# Altium schematic sheet vl822.SchDoc
size A3; SheetNumber: 4; SheetTotal: 4
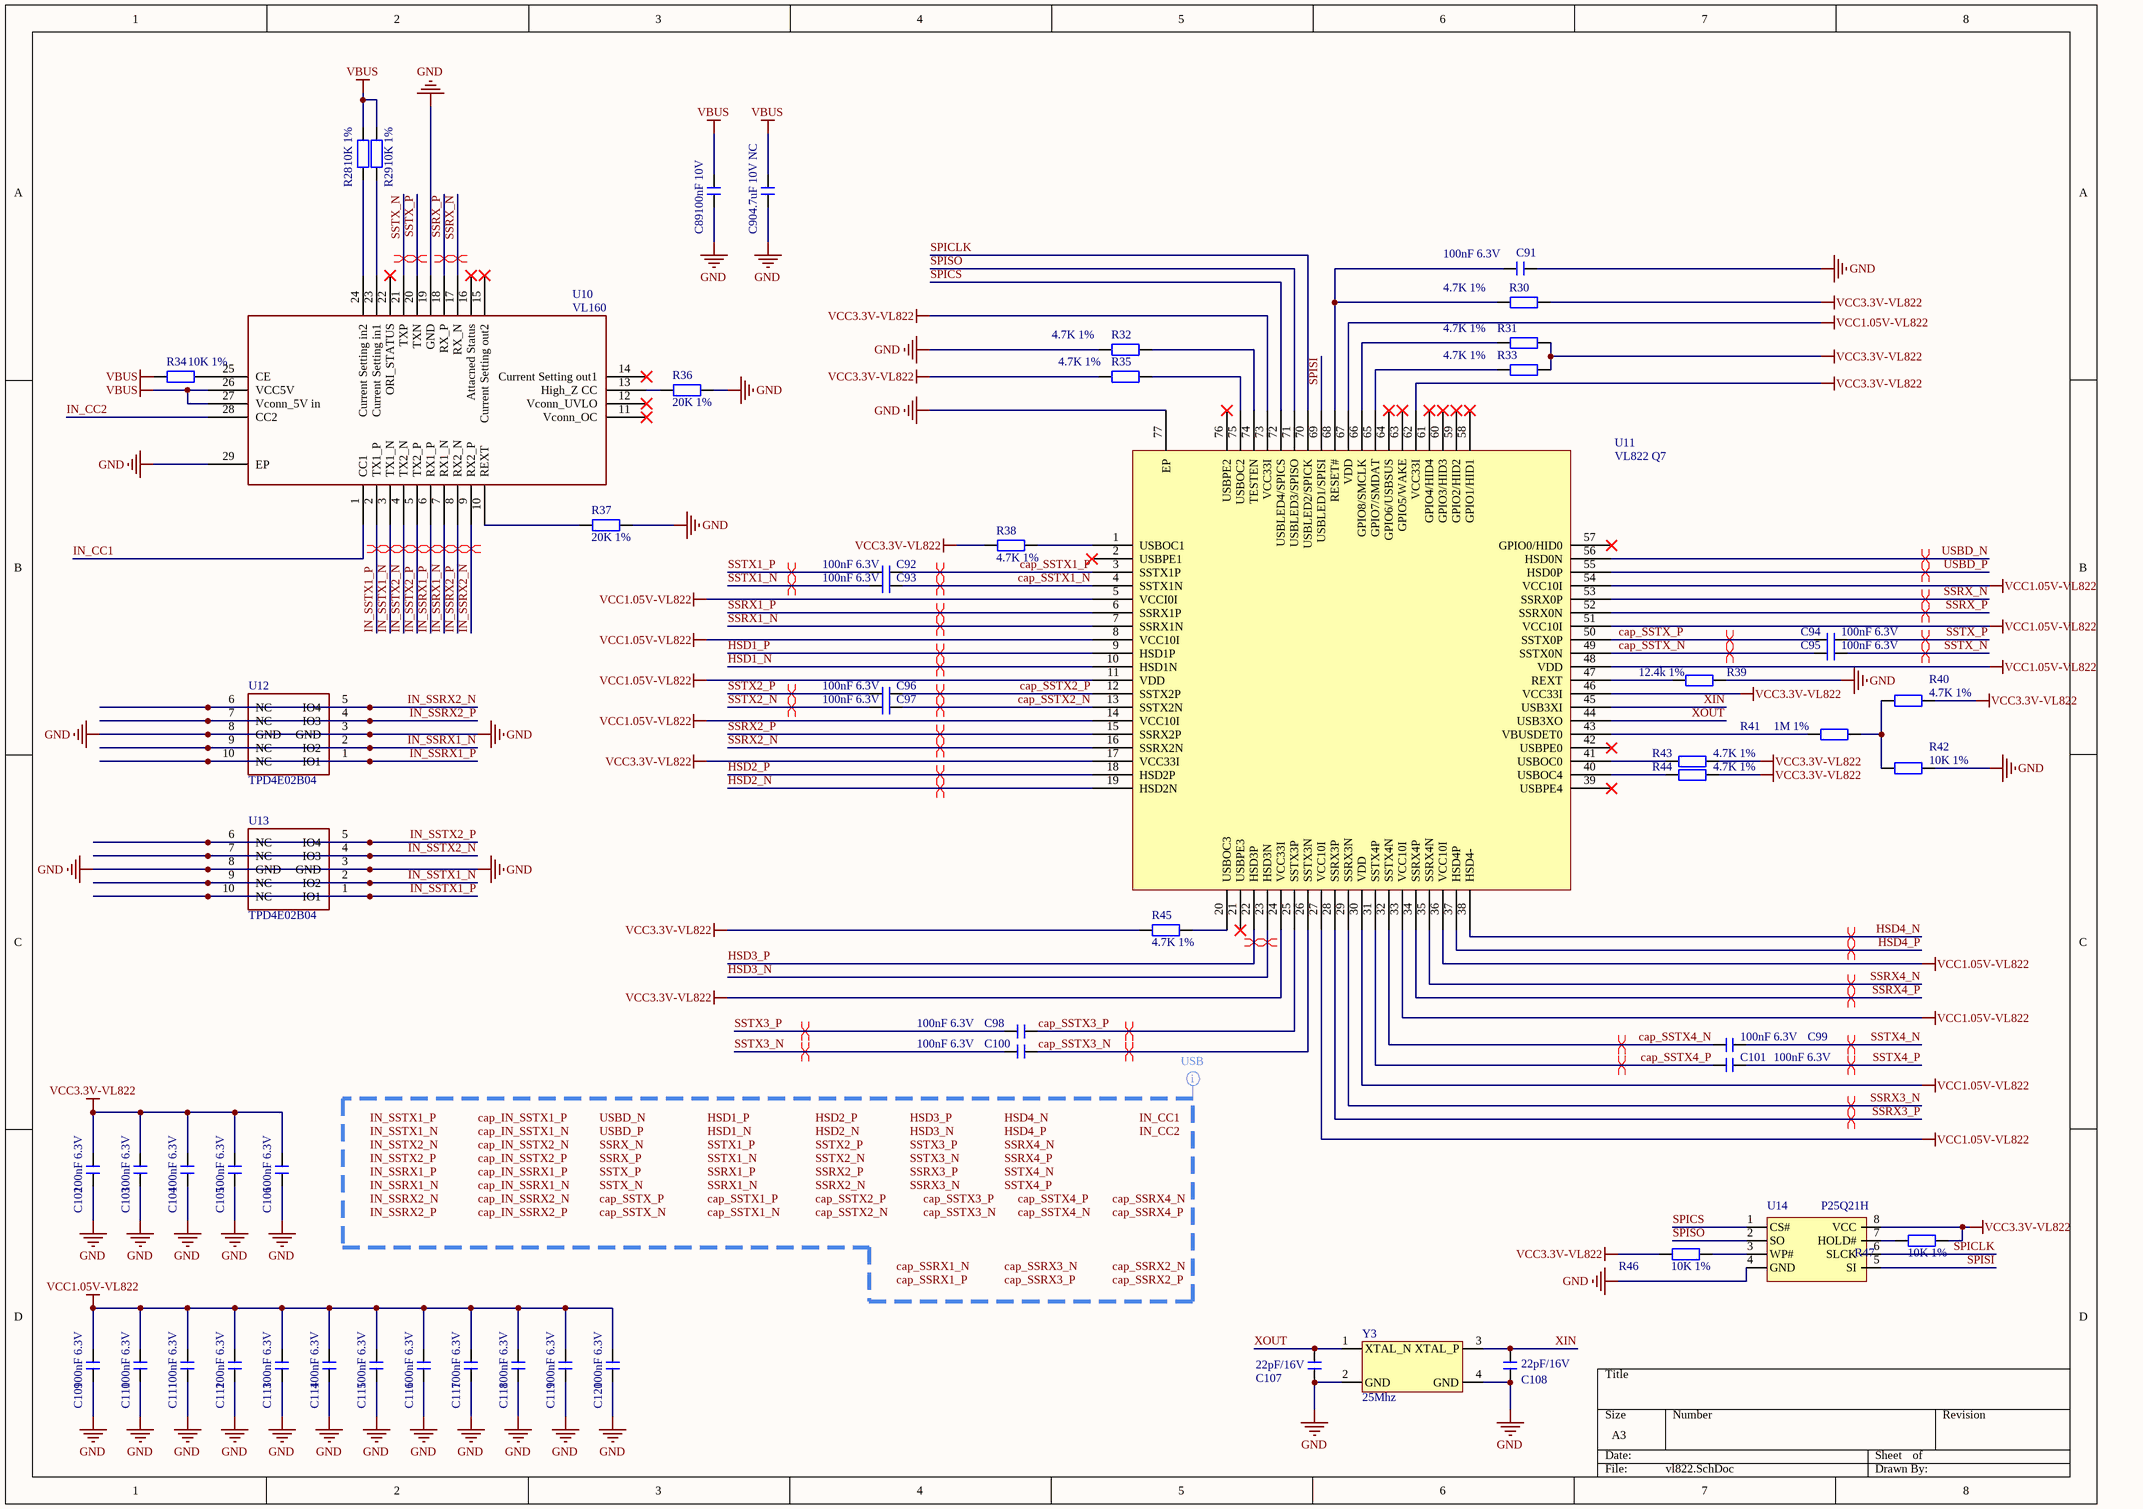
[diagram p0: vl822.SchDoc]

## Parts
C89  100nF 10V  [C0402_L]
C90  4.7uF 10V NC  [C0402_L]
C91  100nF 6.3V  [C0402_L]
C92  100nF 6.3V  [C0402_L]
C93  100nF 6.3V  [C0402_L]
C94  100nF 6.3V  [C0402_L]
C95  100nF 6.3V  [C0402_L]
C96  100nF 6.3V  [C0402_L]
C97  100nF 6.3V  [C0402_L]
C98  100nF 6.3V  [C0402_L]
C99  100nF 6.3V  [C0402_L]
C100  100nF 6.3V  [C0402_L]
C101  100nF 6.3V  [C0402_L]
C102  100nF 6.3V  [C0402_L]
C103  100nF 6.3V  [C0402_L]
C104  100nF 6.3V  [C0402_L]
C105  100nF 6.3V  [C0402_L]
C106  100nF 6.3V  [C0402_L]
C107  22pF/16V  [C0402_L]
C108  22pF/16V  [C0402_L]
C109  100nF 6.3V  [C0402_L]
C110  100nF 6.3V  [C0402_L]
C111  100nF 6.3V  [C0402_L]
C112  100nF 6.3V  [C0402_L]
C113  100nF 6.3V  [C0402_L]
C114  100nF 6.3V  [C0402_L]
C115  100nF 6.3V  [C0402_L]
C116  100nF 6.3V  [C0402_L]
C117  100nF 6.3V  [C0402_L]
C118  100nF 6.3V  [C0402_L]
C119  100nF 6.3V  [C0402_L]
C120  100nF 6.3V  [C0402_L]
R28  10K 1%  [R0402_L]
R29  10K 1%  [R0402_L]
R30  4.7K 1%  [R0402_L]
R31  4.7K 1%  [R0402_L]
R32  4.7K 1%  [R0402_L]
R33  4.7K 1%  [R0402_L]
R34  10K 1%  [R0402_L]
R35  4.7K 1%  [R0402_L]
R36  20K 1%  [R0402_L]
R37  20K 1%  [R0402_L]
R38  4.7K 1%  [R0402_L]
R39  12.4k 1%  [R0402_L]
R40  4.7K 1%  [R0402_L]
R41  1M 1%  [R0402_L]
R42  10K 1%  [R0402_L]
R43  4.7K 1%  [R0402_L]
R44  4.7K 1%  [R0402_L]
R45  4.7K 1%  [R0402_L]
R46  10K 1%  [R0402_L]
R47  10K 1%  [R0402_L]
U10  VL160  [MQFN-28_L4.5-W3.5-P0.40-BL-EP]
U11  VL822 Q7  [QFN-76_L9.0-W9.0-P0.40-EP6.3-TL]
U12  TPD4E02B04  [DIO_TPD4E02B04DQAR]
U13  TPD4E02B04  [DIO_TPD4E02B04DQAR]
U14  P25Q21H  [SOP8_L]
Y3  25Mhz  [OSC 3225-4P]

## Nets
GND: C89.1 C90.1 C91.2 C102.1 C103.1 C104.1 C105.1 C106.1 C107.2 C108.2 C109.1 C110.1 C111.1 C112.1 C113.1 C114.1 C115.1 C116.1 C117.1 C118.1 C119.1 C120.1 R32.2 R36.1 R37.1 R39.2 R42.2 U10.19(GND) U10.29(EP) U11.77(EP) U12.3(GND) U12.8(GND) U13.3(GND) U13.8(GND) U14.4(GND) Y3.2(GND) Y3.4(GND)
VBUS: C89.2 C90.2 R28.1 R29.1 R34.2 U10.26(VCC5V) U10.27(Vconn_5V_in)
VCC1.05V-VL822: C109.2 C110.2 C111.2 C112.2 C113.2 C114.2 C115.2 C116.2 C117.2 C118.2 C119.2 C120.2 U11.5(VCCI0I) U11.8(VCC10I) U11.11(VDD) U11.14(VCC10I) U11.27(VCC10I) U11.30(VDD) U11.33(VCC10I) U11.36(VCC10I) U11.48(VDD) U11.51(VCC10I) U11.54(VCC10I) U11.67(VDD)
VCC3.3V-VL822: C102.2 C103.2 C104.2 C105.2 C106.2 R30.2 R31.2 R33.2 R35.2 R38.2 R40.2 R43.2 R44.2 R45.2 R46.2 R47.1 U11.17(VCC33I) U11.24(VCC33I) U11.46(VCC33I) U11.62(VCC33I) U11.73(VCC33I) U14.8(VCC)
cap_SSTX1_N: C93.2 U11.4(SSTX1N)
cap_SSTX1_P: C92.2 U11.3(SSTX1P)
cap_SSTX2_N: C97.2 U11.13(SSTX2N)
cap_SSTX2_P: C96.2 U11.12(SSTX2P)
cap_SSTX3_N: C100.2 U11.26(SSTX3N)
cap_SSTX3_P: C98.2 U11.25(SSTX3P)
cap_SSTX4_N: C99.2 U11.32(SSTX4N)
cap_SSTX4_P: C101.2 U11.31(SSTX4P)
cap_SSTX_N: C95.2 U11.49(SSTX0N)
cap_SSTX_P: C94.2 U11.50(SSTX0P)
HSD1_N: U11.10(HSD1N)
HSD1_P: U11.9(HSD1P)
HSD2_N: U11.19(HSD2N)
HSD2_P: U11.18(HSD2P)
HSD3_N: U11.23(HSD3N)
HSD3_P: U11.22(HSD3P)
HSD4_N: U11.38(HSD4-)
HSD4_P: U11.37(HSD4P)
IN_CC1: U10.1(CC1)
IN_CC2: U10.28(CC2)
IN_SSRX1_N: U10.7(RX1_N) U12.2(IO2) U12.9(NC)
IN_SSRX1_P: U10.6(RX1_P) U12.1(IO1) U12.10(NC)
IN_SSRX2_N: U10.9(RX2_P) U12.5(IO4) U12.6(NC)
IN_SSRX2_P: U10.8(RX2_N) U12.4(IO3) U12.7(NC)
IN_SSTX1_N: U10.3(TX1_N) U13.2(IO2) U13.9(NC)
IN_SSTX1_P: U10.2(TX1_P) U13.1(IO1) U13.10(NC)
IN_SSTX2_N: U10.4(TX2_N) U13.4(IO3) U13.7(NC)
IN_SSTX2_P: U10.5(TX2_P) U13.5(IO4) U13.6(NC)
SPICLK: U11.70(USBLED2/SPICK) U14.6(SLCK)
SPICS: U11.72(USBLED4/SPICS) U14.1(CS#)
SPISI: U11.69(USBLED1/SPISI) U14.5(SI)
SPISO: U11.71(USBLED3/SPISO) U14.2(SO)
SSRX1_N: U11.7(SSRX1N)
SSRX1_P: U11.6(SSRX1P)
SSRX2_N: U11.16(SSRX2N)
SSRX2_P: U11.15(SSRX2P)
SSRX3_N: U11.29(SSRX3N)
SSRX3_P: U11.28(SSRX3P)
SSRX4_N: U11.35(SSRX4N)
SSRX4_P: U11.34(SSRX4P)
SSRX_N: U10.17(RX_N) U11.53(SSRX0P)
SSRX_P: U10.18(RX_P) U11.52(SSRX0N)
SSTX1_N: C93.1
SSTX1_P: C92.1
SSTX2_N: C97.1
SSTX2_P: C96.1
SSTX3_N: C100.1
SSTX3_P: C98.1
SSTX4_N: C99.1
SSTX4_P: C101.1
SSTX_N: C95.1 U10.21(TXP)
SSTX_P: C94.1 U10.20(TXN)
USBD_N: U11.56(HSD0N)
USBD_P: U11.55(HSD0P)
XIN: C108.1 U11.45(USB3XI) Y3.3(XTAL_P)
XOUT: C107.1 U11.44(USB3XO) Y3.1(XTAL_N)
NetC91_1: C91.1 R30.1 U11.68(RESET#)
NetR28_2: R28.2 U10.24(Current_Setting_in2)
NetR29_2: R29.2 U10.23(Current_Setting_in1)
NetR31_1: R31.1 U11.66(GPIO8/SMCLK)
NetR32_1: R32.1 U11.74(TESTEN)
NetR33_1: R33.1 U11.65(GPIO7/SMDAT)
NetR34_1: R34.1 U10.25(CE)
NetR35_1: R35.1 U11.75(USBOC2)
NetR36_2: R36.2 U10.13(High_Z_CC)
NetR37_2: R37.2 U10.10(REXT)
NetR38_1: R38.1 U11.1(USBOC1)
NetR39_1: R39.1 U11.47(REXT)
NetR40_1: R40.1 R41.2 R42.1
NetR41_1: R41.1 U11.43(VBUSDET0)
NetR43_1: R43.1 U11.41(USBOC0)
NetR44_1: R44.1 U11.40(USBOC4)
NetR45_1: R45.1 U11.20(USBOC3)
NetR46_1: R46.1 U14.3(WP#)
NetR47_2: R47.2 U14.7(HOLD#)

Not connected (* = marked no-connect by the designer): U10 11(Vconn_OC)* 12(Vconn_UVLO)* 14(Current_Setting_out1)* 15(Current_Setting_out2)* 16(Attacned_Status)* 22(ORI_STATUS)*; U11 2(USBPE1)* 21(USBPE3)* 39(USBPE4)* 42(USBPE0)* 57(GPIO0/HID0)* 58(GPIO1/HID1)* 59(GPIO2/HID2)* 60(GPIO3/HID3)* 61(GPIO4/HID4)* 63(GPIO5/WAKE)* 64(GPIO6/USBSUS)* 76(USBPE2)*

## Layout directives
differential pair: cap_SSTX1_N, cap_SSTX1_P, cap_SSTX2_N, cap_SSTX2_P, cap_SSTX3_N, cap_SSTX3_P, cap_SSTX4_N, cap_SSTX4_P, cap_SSTX_N, cap_SSTX_P, HSD1_N, HSD1_P, HSD2_N, HSD2_P, HSD3_N, HSD3_P, HSD4_N, HSD4_P, IN_SSRX1_N, IN_SSRX1_P, IN_SSRX2_N, IN_SSRX2_P, IN_SSTX1_N, IN_SSTX1_P, IN_SSTX2_N, IN_SSTX2_P, SSRX1_N, SSRX1_P, SSRX2_N, SSRX2_P, SSRX3_N, SSRX3_P, SSRX4_N, SSRX4_P, SSRX_N, SSRX_P, SSTX1_N, SSTX1_P, SSTX2_N, SSTX2_P, SSTX3_N, SSTX3_P, SSTX4_N, SSTX4_P, SSTX_N, SSTX_P, USBD_N, USBD_P
net class USB; rule Differential Pairs Routing [Pref Gap = 5mil    Min Gap  = 5mil    Max Gap  = 5milPref Width = 5.1mil    Min Width  = 5.1mil    Max Width  = 5.1mil]; rule Routing Via Style [Pref Size = 0.4mm    Pref Hole Size = 0.3mm]: cap_IN_SSRX1_N, cap_IN_SSRX1_P, cap_IN_SSRX2_N, cap_IN_SSRX2_P, cap_IN_SSTX1_N, cap_IN_SSTX1_P, cap_IN_SSTX2_N, cap_IN_SSTX2_P, cap_SSRX1_N, cap_SSRX1_P, cap_SSRX2_N, cap_SSRX2_P, cap_SSRX3_N, cap_SSRX3_P, cap_SSRX4_N, cap_SSRX4_P, cap_SSTX1_N, cap_SSTX1_P, cap_SSTX2_N, cap_SSTX2_P, cap_SSTX3_N, cap_SSTX3_P, cap_SSTX4_N, cap_SSTX4_P, cap_SSTX_N, cap_SSTX_P, HSD1_N, HSD1_P, HSD2_N, HSD2_P, HSD3_N, HSD3_P, HSD4_N, HSD4_P, IN_CC1, IN_CC2, IN_SSRX1_N, IN_SSRX1_P, IN_SSRX2_N, IN_SSRX2_P, IN_SSTX1_N, IN_SSTX1_P, IN_SSTX2_N, IN_SSTX2_P, SSRX1_N, SSRX1_P, SSRX2_N, SSRX2_P, SSRX3_N, SSRX3_P, SSRX4_N, SSRX4_P, SSRX_N, SSRX_P, SSTX1_N, SSTX1_P, SSTX2_N, SSTX2_P, SSTX3_N, SSTX3_P, SSTX4_N, SSTX4_P, SSTX_N, SSTX_P, USBD_N, USBD_P

## Notes on the sheet
- Labels drawn without touching a wire or pin: cap_IN_SSRX1_N, cap_IN_SSRX1_P, cap_IN_SSRX2_N, cap_IN_SSRX2_P, cap_IN_SSTX1_N, cap_IN_SSTX1_P, cap_IN_SSTX2_N, cap_IN_SSTX2_P, cap_SSRX1_N, cap_SSRX1_P, cap_SSRX2_N, cap_SSRX2_P, cap_SSRX3_N, cap_SSRX3_P, cap_SSRX4_N, cap_SSRX4_P, cap_SSTX1_N, cap_SSTX1_P, cap_SSTX2_N, cap_SSTX2_P, cap_SSTX3_N, cap_SSTX3_P, cap_SSTX4_N, cap_SSTX4_P, cap_SSTX_N, cap_SSTX_P, HSD1_N, HSD1_P, HSD2_N, HSD2_P, HSD3_N, HSD3_P, HSD4_N, HSD4_P, IN_CC1, IN_CC2, IN_SSRX1_N, IN_SSRX1_P, IN_SSRX2_N, IN_SSRX2_P, IN_SSTX1_N, IN_SSTX1_P, IN_SSTX2_N, IN_SSTX2_P, SSRX1_N, SSRX1_P, SSRX2_N, SSRX2_P, SSRX3_N, SSRX3_P, SSRX4_N, SSRX4_P, SSRX_N, SSRX_P, SSTX1_N, SSTX1_P, SSTX2_N, SSTX2_P, SSTX3_N, SSTX3_P, SSTX4_N, SSTX4_P, SSTX_N, SSTX_P, USBD_N, USBD_P

## Library data of the parts
C89-C120 = C: 无极性贴片电容; 版权归属: 源创客; 材质: X7R; BOM名称: 无极性贴片电容; 学习资源: www.ooocke.com
R28-R47 = R: 贴片电阻; 版权归属: 源创客; BOM名称: 贴片电阻; 学习资源: www.ooocke.com
U12 U13 = TPD4E02B04: ESD
U14 = P25D40H
Y3 = Crystal